# EAGLE design small-clearance (EAGLE 5.11)
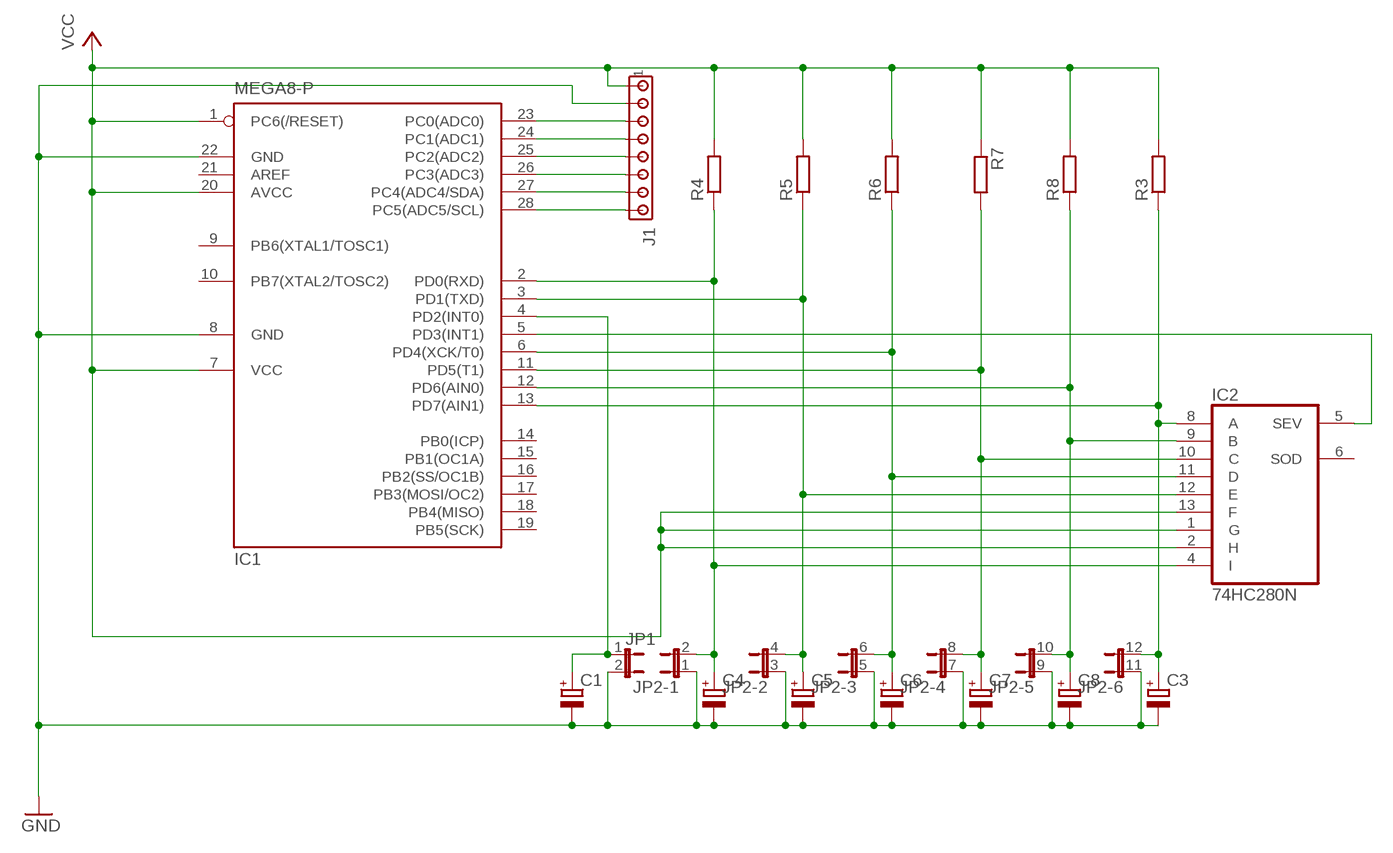
[diagram p0: schematic, sheet 1]

## Parts
C1  CPOL-EUE2-5  [E2-5]
C3  CPOL-EUE2-5  [E2-5]
C4  CPOL-EUE2-5  [E2-5]
C5  CPOL-EUE2-5  [E2-5]
C6  CPOL-EUE2-5  [E2-5]
C7  CPOL-EUE2-5  [E2-5]
C8  CPOL-EUE2-5  [E2-5]
IC1  MEGA8-P  [DIL28-3]
IC2  74HC280N  [DIL14]
J1  MTA08-100  [10X08MTA]
JP1  JP1E  [JP1]
JP2  JP6QE  [JP6Q]
R3  R-EU_0204/7  [0204/7]
R4  R-EU_0204/7  [0204/7]
R5  R-EU_0204/7  [0204/7]
R6  R-EU_0204/7  [0204/7]
R7  R-EU_0204/7  [0204/7]
R8  R-EU_0204/7  [0204/7]

## Nets
GND: C1.- C3.- C4.- C5.- C6.- C7.- C8.- IC1.8(GND) IC1.22(GND) J1.2 JP1.2 JP2.1 JP2.3 JP2.5 JP2.7 JP2.9 JP2.11
N$1: IC1.23(PC0(ADC0)) J1.3
N$2: IC1.24(PC1(ADC1)) J1.4
N$3: IC1.25(PC2(ADC2)) J1.5
N$4: IC1.26(PC3(ADC3)) J1.6
N$5: IC1.27(PC4(ADC4/SDA)) J1.7
N$6: IC1.28(PC5(ADC5/SCL)) J1.8
N$7: IC1.5(PD3(INT1)) IC2.5(SEV)
N$9: C3.+ IC1.13(PD7(AIN1)) IC2.8(A) JP2.12 R3.1
N$10: C5.+ IC1.3(PD1(TXD)) IC2.12(E) JP2.4 R5.1
N$11: C7.+ IC1.11(PD5(T1)) IC2.10(C) JP2.8 R7.2
N$12: C6.+ IC1.6(PD4(XCK/T0)) IC2.11(D) JP2.6 R6.1
N$14: C4.+ IC1.2(PD0(RXD)) IC2.4(I) JP2.2 R4.1
N$15: C8.+ IC1.12(PD6(AIN0)) IC2.9(B) JP2.10 R8.1
VCC: IC1.1(PC6(/RESET)) IC1.7(VCC) IC1.20(AVCC) IC2.1(G) IC2.2(H) IC2.13(F) J1.1 R3.2 R4.2 R5.2 R6.2 R7.1 R8.2
WHEEL_SENSOR: C1.+ IC1.4(PD2(INT0)) JP1.1
Unconnected: IC1.9(PB6(XTAL1/TOSC1)) IC1.10(PB7(XTAL2/TOSC2)) IC1.14(PB0(ICP)) IC1.15(PB1(OC1A)) IC1.16(PB2(SS/OC1B)) IC1.17(PB3(MOSI/OC2)) IC1.18(PB4(MISO)) IC1.19(PB5(SCK)) IC1.21(AREF) IC2.6(SOD)

## Power pins joined to a net without a drawn wire
GND: IC2.7(GND)
VCC: IC2.14(VCC)

## Library data of the parts
C1 C3-C8 = rcl:CPOL-EU: POLARIZED CAPACITOR, European symbol
IC1 = atmel:MEGA8-P: MICROCONTROLLER 8 Kbytes FLASH, 1 kbytes SRAM, 512 bytes EEPROM, USART, 4-channel 10 bit ADC, 2-channel 8 bit ADC Pin compatible with Atmega48, ATMega88, ATMega168 Source: avr.lbr; OC_FARNELL: unknown; OC_NEWARK: unknown
IC2 = 74xx-eu:74*280: 9-bit odd/even PARITY GENERATOR/CHECKER
J1 = con-amp:MTA08-100: AMP connector; OC_FARNELL: unknown; OC_NEWARK: unknown
JP1 = jumper:JP1E: JUMPER
JP2 = jumper:JP6QE: JUMPER
R3-R8 = rcl:R-EU_: RESISTOR, European symbol

## Board
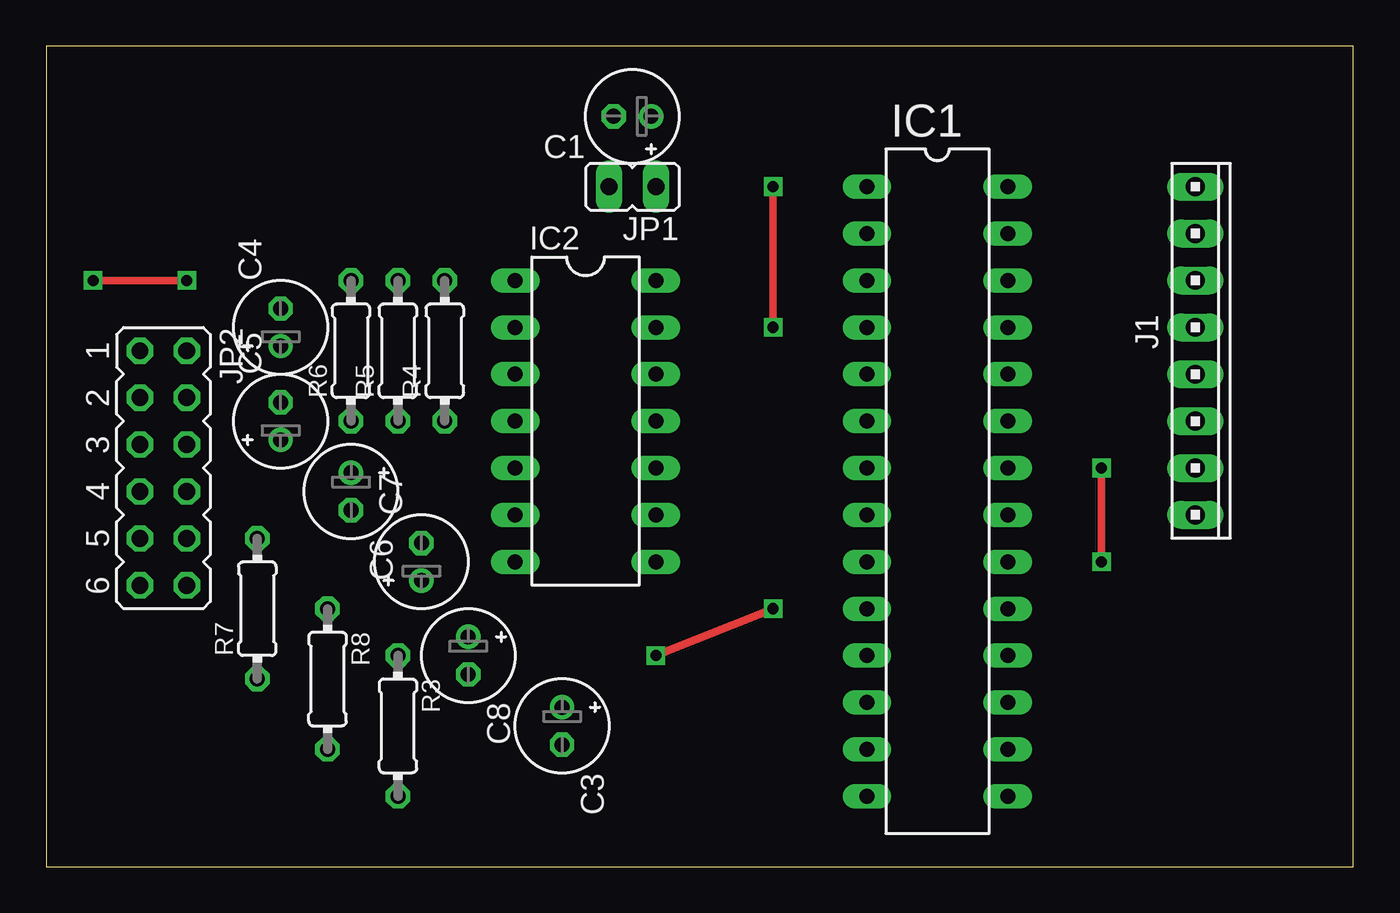
[diagram p1: board, top side]
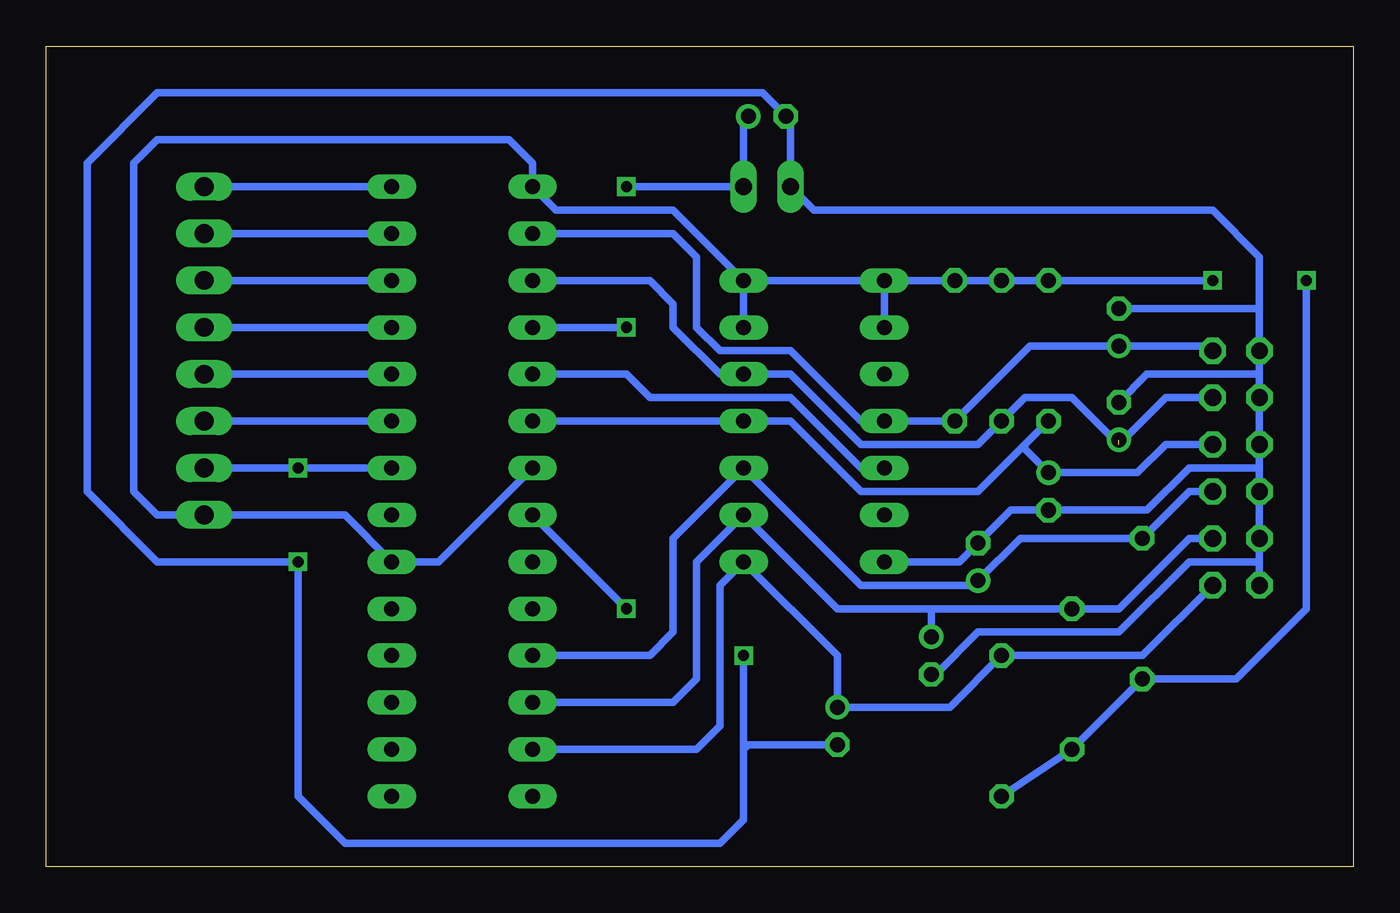
[diagram p2: board, bottom side, seen from below]

Size 70.79 x 44.44 mm. Coordinates in mm from the lower left corner, seen from the top.
Outline: 0,0 70.79,0 70.79,44.44 0,44.44 0,0
Copper layers (1*16): Top 0.035mm / dielectric 1.5mm / Bottom 0mm
Design rules "default *": minimum track width 10mil, minimum drill 24mil, track to track 8mil, track to pad 8mil, pad to pad 8mil, via to via 8mil, smd to smd 8mil, copper to edge 40mil, drill to drill 8mil, minimum pad ring 10mil, minimum via ring 8mil, stop-mask expansion 4mil, vias tented up to drill 0mil, thermal gap 10mil

### Footprints (pad centres in the part's own frame; a part is rotated, then mirrored left to right if it is on the bottom)
E2-5 = drill 0.813 pad 1.27 round: + -1.016,0 | drill 0.813 pad 1.27 octagon: - 1.016,0
DIL28-3 = drill 0.813 long: 1 -16.51,-3.81; 2 -13.97,-3.81; 3 -11.43,-3.81; 4 -8.89,-3.81; 5 -6.35,-3.81; 6 -3.81,-3.81; 7 -1.27,-3.81; 8 1.27,-3.81; 9 3.81,-3.81; 10 6.35,-3.81; 11 8.89,-3.81; 12 11.43,-3.81; 13 13.97,-3.81; 14 16.51,-3.81; 15 16.51,3.81; 16 13.97,3.81; 17 11.43,3.81; 18 8.89,3.81; 19 6.35,3.81; 20 3.81,3.81; 21 1.27,3.81; 22 -1.27,3.81; 23 -3.81,3.81; 24 -6.35,3.81; 25 -8.89,3.81; 26 -11.43,3.81; 27 -13.97,3.81; 28 -16.51,3.81
DIL14 = drill 0.813 long: 1 -7.62,-3.81; 2 -5.08,-3.81; 3 -2.54,-3.81; 4 0,-3.81; 5 2.54,-3.81; 6 5.08,-3.81; 7 7.62,-3.81; 8 7.62,3.81; 9 5.08,3.81; 10 2.54,3.81; 11 0,3.81; 12 -2.54,3.81; 13 -5.08,3.81; 14 -7.62,3.81
10X08MTA = drill 1.016 long: 1 8.89,0; 2 6.35,0; 3 3.81,0; 4 1.27,0; 5 -1.27,0; 6 -3.81,0; 7 -6.35,0; 8 -8.89,0
JP1 = drill 0.914 long: 1 0,-1.27; 2 0,1.27
JP6Q = drill 0.914 octagon: 1 -6.35,-1.27; 2 -6.35,1.27; 3 -3.81,-1.27; 4 -3.81,1.27; 5 -1.27,-1.27; 6 -1.27,1.27; 7 1.27,-1.27; 8 1.27,1.27; 9 3.81,-1.27; 10 3.81,1.27; 11 6.35,-1.27; 12 6.35,1.27
0204/7 = drill 0.813 octagon: 1 -3.81,0; 2 3.81,0

### Placement (x,y rotation side)
C1  31.75,40.64 180 top
C3  27.94,7.62 270 top
C4  12.7,29.21 90 top
C5  12.7,24.13 90 top
C6  16.51,20.32 270 top
C7  20.32,16.51 90 top
C8  22.86,11.43 270 top
IC1  48.26,20.32 270 top
IC2  29.21,24.13 270 top
J1  62.23,27.94 270 top
JP1  31.75,36.83 90 top
JP2  6.35,21.59 270 top
R3  19.05,7.62 270 top
R4  21.59,27.94 90 top
R5  19.05,27.94 90 top
R6  16.51,27.94 90 top
R7  11.43,13.97 90 top
R8  15.24,10.16 270 top

### Tracks (layer width: path | path; a pad name or v marks a point on that pad's centre or on a via)
GND  (via drill 0.6)
  Top 0.406: v57.15,16.51 v57.15,21.59 | v33.02,11.43 v39.37,13.97
  Bottom 0.406: IC1.22 v57.15,21.59 J1.2 | 33.02,6.35 33.02,2.54 34.29,1.27 54.61,1.27 57.15,3.81 v57.15,16.51 64.77,16.51 68.58,20.32 68.58,38.1 64.77,41.91 32,41.91 C1.- 30.48,40.39 JP1.2 29.21,35.56 7.62,35.56 5.08,33.02 5.08,30.23 | 33.02,6.35 v33.02,11.43 | v39.37,13.97 IC1.8 | 5.08,30.23 JP2.1 5.08,26.67 | 5.08,21.59 JP2.7 JP2.9 5.08,16.51 | 5.08,21.59 JP2.5 JP2.3 5.08,26.67 | JP2.11 5.08,16.51 | 5.08,30.23 C4.- | C8.- 22.61,10.41 20.32,12.7 12.7,12.7 8.89,16.51 5.08,16.51 | C5.- 11.18,26.67 5.08,26.67 | 5.08,21.59 8.89,21.59 11.18,19.3 C6.- 18.54,19.3 C7.- 21.34,16.51 IC2.7 | C3.- 32.77,6.6 33.02,6.35
N$1
  Bottom 0.406: IC1.23 J1.3
N$2
  Bottom 0.406: IC1.24 J1.4
N$3
  Bottom 0.406: IC1.25 J1.5
N$4
  Bottom 0.406: IC1.26 J1.6
N$5
  Bottom 0.406: IC1.27 J1.7
N$6
  Bottom 0.406: IC1.28 J1.8
N$7
  Bottom 0.406: IC2.5 26.67,21.59 30.48,25.4 38.1,25.4 39.37,26.67 IC1.5
N$9
  Bottom 0.406: IC1.13 35.56,6.35 34.29,7.62 34.29,15.24 IC2.8 27.94,11.43 C3.+ 21.84,8.64 R3.1 11.43,11.43 JP2.12
N$10  (1 unrouted)
  Bottom 0.406: IC1.3 38.1,31.75 36.83,30.48 36.83,29.21 34.29,26.67 IC2.12 30.48,26.67 26.67,22.86 20.32,22.86 R5.1 17.78,25.4 15.24,25.4 12.7,22.86 10.16,25.4 JP2.4
N$11
  Bottom 0.406: IC1.11 38.1,11.43 36.83,12.7 36.83,17.78 IC2.10 26.67,15.24 20.57,15.24 C7.+ 18.03,17.78 R7.2 8.89,20.32 JP2.8
N$12
  Bottom 0.406: IC1.6 IC2.11 30.48,24.13 26.67,20.32 20.32,20.32 17.78,22.86 | 17.78,22.86 R6.1 | JP2.6 10.16,22.86 11.68,21.34 C6.+ 17.78,22.61 17.78,22.86
N$14
  Bottom 0.406: IC1.2 36.83,34.29 35.56,33.02 35.56,29.21 34.29,27.94 30.48,27.94 26.67,24.13 IC2.4 R4.1 17.53,28.19 C4.+ 7.87,28.19 JP2.2
N$15
  Bottom 0.406: IC1.12 36.83,8.89 35.56,10.16 35.56,16.51 IC2.9 27.94,13.97 22.86,13.97 | 22.86,13.97 R8.1 12.7,13.97 8.89,17.78 JP2.10 | 22.86,13.97 C8.+
VCC  (via drill 0.6)
  Top 0.406: v2.54,31.75 v7.62,31.75
  Bottom 0.406: IC2.14 IC2.13 | IC2.1 IC2.14 | IC1.7 49.53,16.51 IC1.20 54.61,19.05 J1.1 64.77,19.05 66.04,20.32 66.04,38.1 64.77,39.37 45.72,39.37 44.45,38.1 IC1.1 43.18,35.56 36.83,35.56 IC2.14 | IC2.1 IC2.2 | IC2.1 R4.2 R5.2 R6.2 v7.62,31.75 | v2.54,31.75 2.54,13.97 6.35,10.16 R7.1 R8.2 R3.2
WHEEL_SENSOR  (via drill 0.6)
  Top 0.406: v39.37,29.21 v39.37,36.83
  Bottom 0.406: v39.37,29.21 IC1.4 | v39.37,36.83 JP1.1 33.02,40.39 C1.+